# EAGLE design pnc_probe (EAGLE 9.6.0)
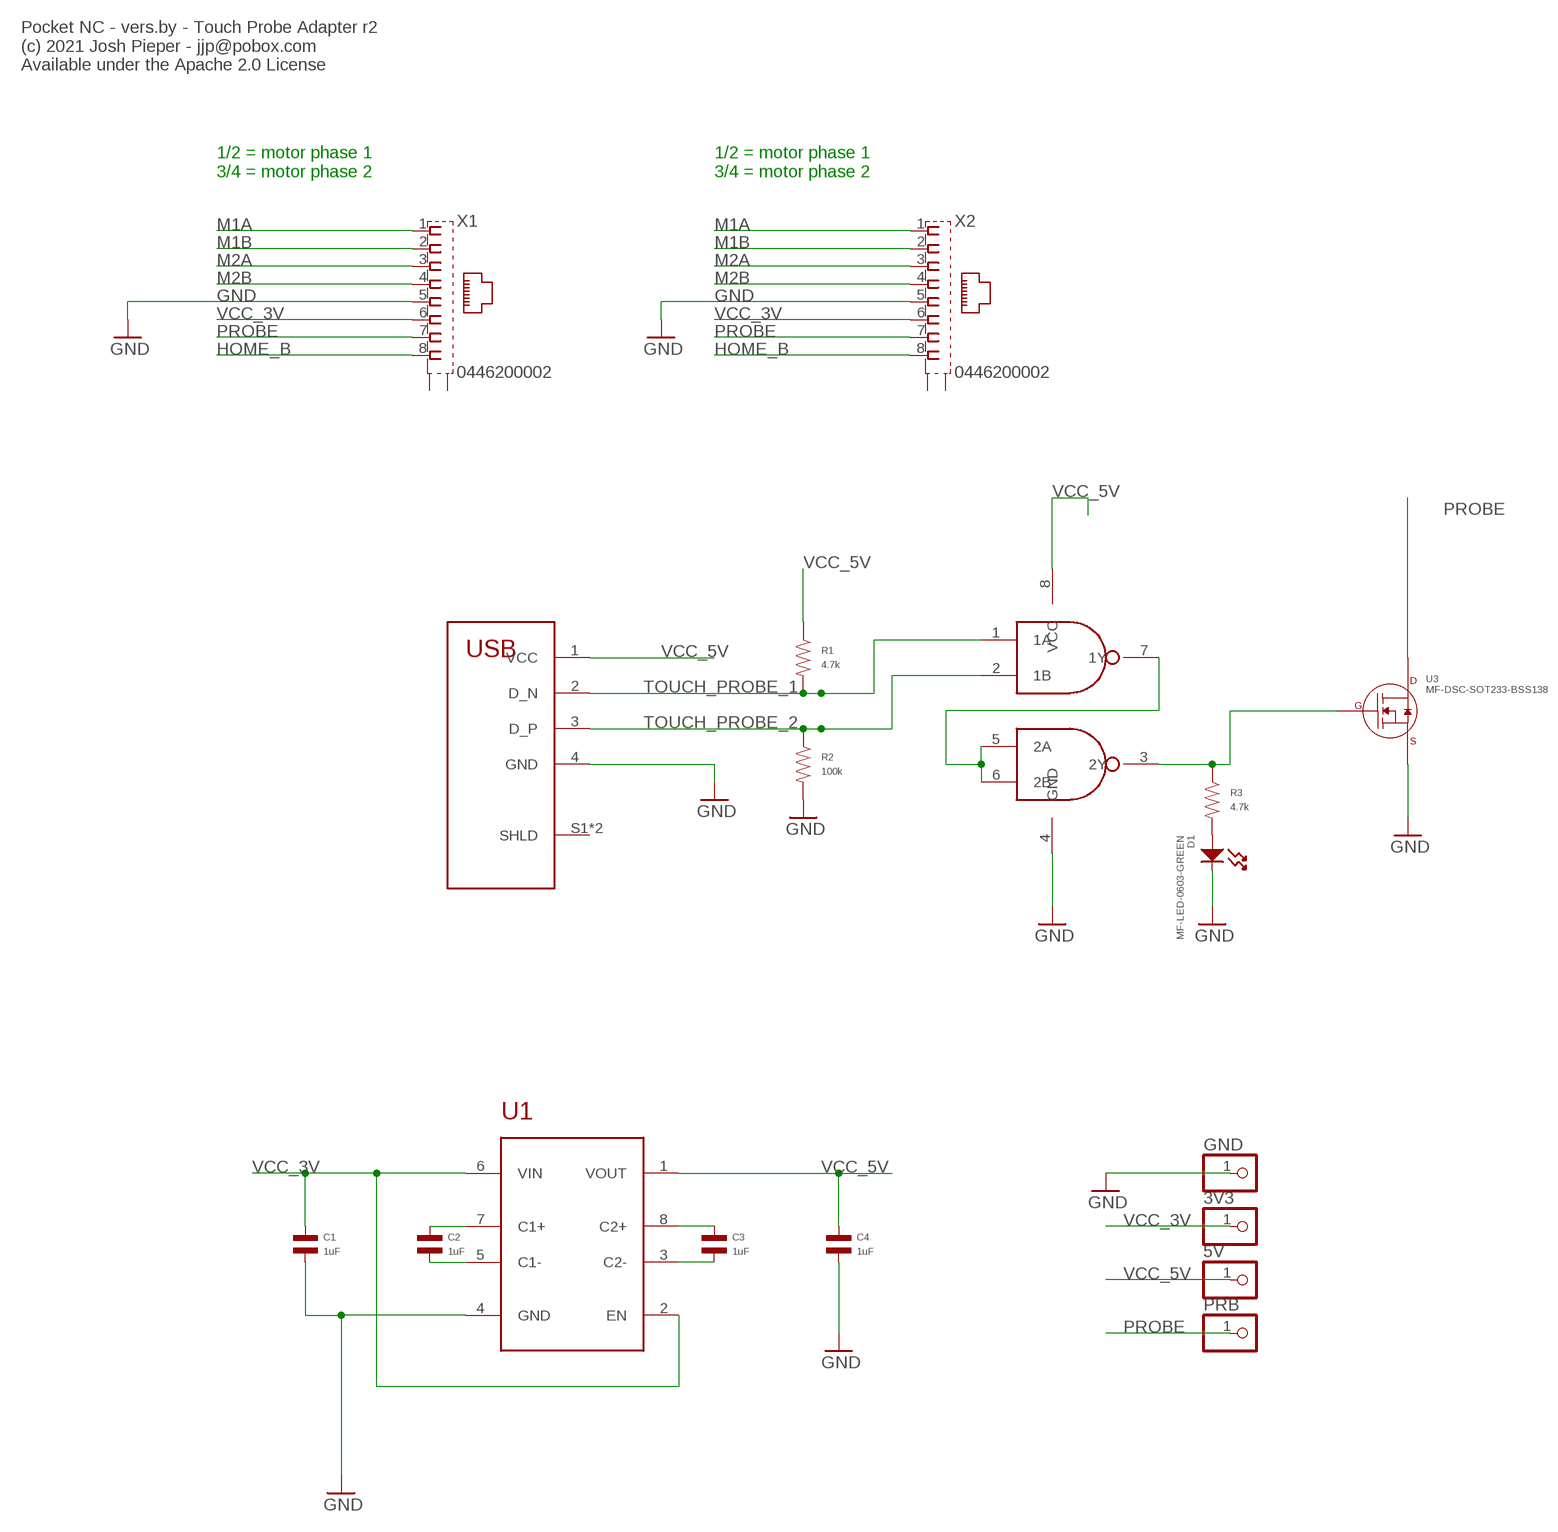
[diagram p0: schematic, sheet 1]

## Parts
3V3  PINHD-1X1  [1X01]
5V  PINHD-1X1  [1X01]
C1  1uF  CAPACITOR_NP_0603  [C0603]
C2  1uF  CAPACITOR_NP_0603  [C0603]
C3  1uF  CAPACITOR_NP_0603  [C0603]
C4  1uF  CAPACITOR_NP_0603  [C0603]
D1  MF-LED-0603-GREEN  LED_SINGLE-0603-GREEN  [LED0603]
GND  PINHD-1X1  [1X01]
PRB  PINHD-1X1  [1X01]
R1  4.7k  RESISTOR_0603  [R0603]
R2  100k  RESISTOR_0603  [R0603]
R3  4.7k  RESISTOR_0603  [R0603]
U1  TPS6024X_VSSOP8  [VSSOP8]
U2  DUAL_NAND_SSOP8  [SSOP8]
U3  MF-DSC-SOT233-BSS138  N-CHANNEL_FET_BSS138_SOT-23-3  [SOT-23-3]
U$1  USBAUSBA  [ONSHORE_USBA_1HSXX]
X1  0446200002  [0446200002]
X2  0446200002  [0446200002]

## Nets
GND: C1.P$2 C4.P$2 D1.CATHODE GND.1 R2.P$2 U1.4(GND) U2.4(GND) U3.P$2(SOURCE) U$1.4(GND) X1.5 X2.5
HOME_B: X1.8 X2.8
M1A: X1.1 X2.1
M1B: X1.2 X2.2
M2A: X1.3 X2.3
M2B: X1.4 X2.4
N$1: U2.5(2A) U2.6(2B) U2.7(1Y)
N$2: C2.P$1 U1.7(C1+)
N$3: D1.ANODE R3.P$2
N$4: R3.P$1 U2.3(2Y) U3.P$1(GATE)
N$5: C2.P$2 U1.5(C1-)
N$6: C3.P$1 U1.8(C2+)
N$7: C3.P$2 U1.3(C2-)
PROBE: PRB.1 U3.P$3(DRAIN) X1.7 X2.7
TOUCH_PROBE_1: R1.P$2 U2.1(1A) U$1.2(D_N)
TOUCH_PROBE_2: R2.P$1 U2.2(1B) U$1.3(D_P)
VCC_3V: 3V3.1 C1.P$1 U1.2(EN) U1.6(VIN) X1.6 X2.6
VCC_5V: 5V.1 C4.P$1 R1.P$1 U1.1(VOUT) U2.8(VCC) U$1.1(VCC)
Unconnected: U$1.S1(SHLD) U$1.S2(SHLD) X1.S@1(S1) X1.S@2(S2) X2.S@1(S1) X2.S@2(S2)

## Notes on the sheet
- Pocket NC - vers.by - Touch Probe Adapter r2
  (c) 2021 Josh Pieper - jjp@pobox.com
  Available under the Apache 2.0 License
- 1/2 = motor phase 1
  3/4 = motor phase 2
- 1/2 = motor phase 1
  3/4 = motor phase 2

## Library data of the parts
3V3 5V GND PRB = pinhead:PINHD-1X1: PIN HEADER
C1-C4 = mfpassives:CAPACITOR_NP: Library: MF_Passives Description: Device for Non-Polarized Capacitors. Manufacture part number (MPN) can be added via Attributes. Check https://factory.macrofab.com/parts for the house parts list.; HOUSEPART: YES; MPN: MF-CAP-0603-1uF; POPULATE: 1
D1 = mfleds:LED_SINGLE: Library: MF_LEDs Description: Device for Single LED Packages. Manufacture part number (MFG#) can be added via Attributes.; HOUSEPART: YES; MPN: MF-LED-0603-GREEN; POPULATE: 1; URL: https://factory.macrofab.com/part/MF-LED-0603-GREEN
R1 = mfpassives:RESISTOR: Library: MF_Passives Description: Device for Resistors. Manufacture part number (MPN), Voltage, Tolerance, and Wattage Rating can be added via Attributes. Check https://factory.macrofab.com/parts for the house parts list.; HOUSEPART: YES; MPN: MF-RES-0603-4.7K; POPULATE: 1
R2 R3 = mfpassives:RESISTOR: Library: MF_Passives Description: Device for Resistors. Manufacture part number (MPN), Voltage, Tolerance, and Wattage Rating can be added via Attributes. Check https://factory.macrofab.com/parts for the house parts list.; HOUSEPART: YES; MPN: MF-RES-0603-100K; POPULATE: 1
U1 = pnc_probe:TPS6024X
U2 = pnc_probe:DUAL_NAND; MF: TI; MPN: SN74LVC2G00DCTR; POPULATE: 1
U3 = mfdiscretesemi:N-CHANNEL_FET: Library: MF_Discrete_Semiconductor Description: Device for Single N-Channel Mosfet. Manufacture part number (MFG#) can be added via Attributes.; HOUSEPART: YES; MPN: MF-DSC-SOT233-BSS138; POPULATE: 1; URL: https://factory.macrofab.com/part/MF-DSC-SOT233-BSS138
U$1 = pnc_probe:USBA; MF: ON SHORE; MPN: USB-A1HSW6; POPULATE: 1
X1 X2 = con-molex:0446200002: RJ-45 INVERTED MODULAR JACK ASSEMBLY WITH RJ-11 KEEPOUT FEATURE Source: Data sheet <http://www.farnell.com/datasheets/73207.pdf> MOLEX 0446200002 BUCHSE, RJ45, GESCHIRMT Source: Farnell <http://de.farnell.com/molex/0446200002/buchse-rj45-geschirmt/dp/9251910?ost=9251910>; MF: MOLEX; MPN: 0446200002; OC_FARNELL: 9251910

## Board
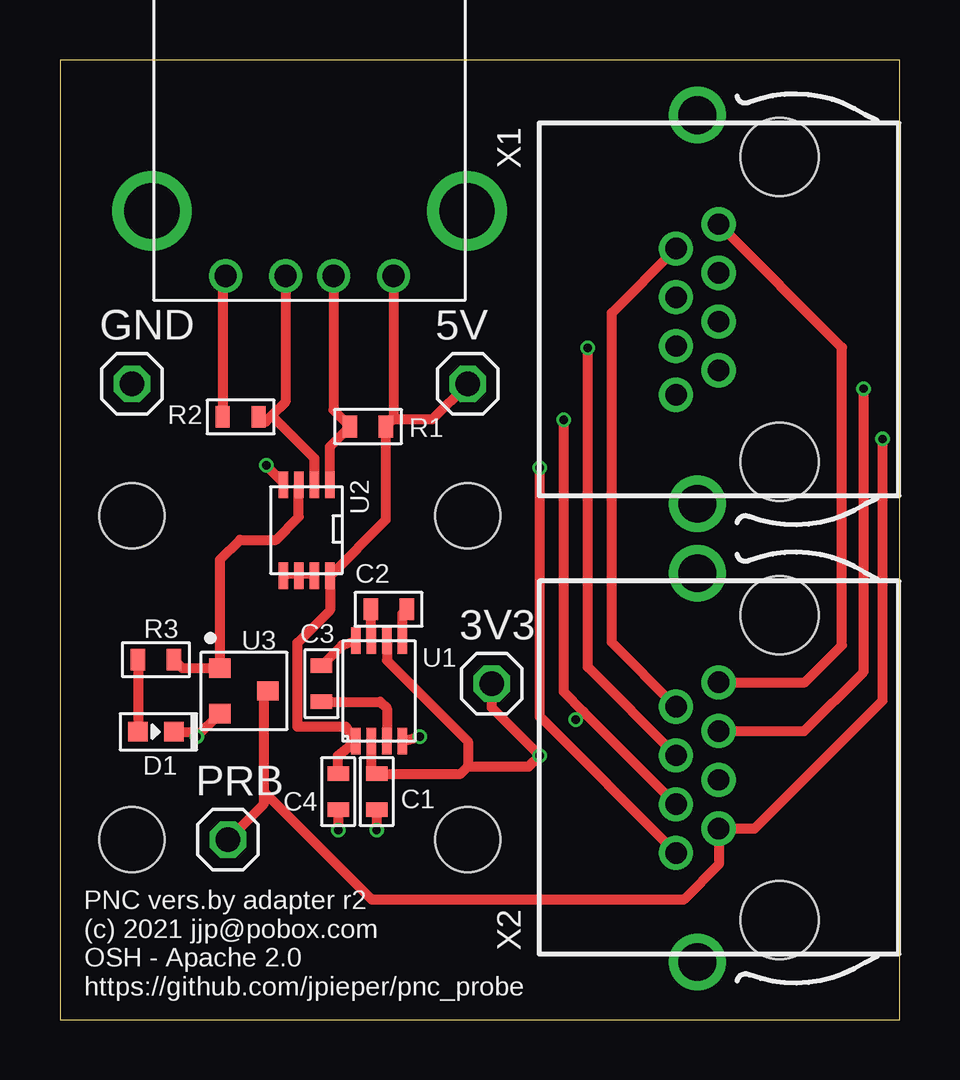
[diagram p1: board, top side]
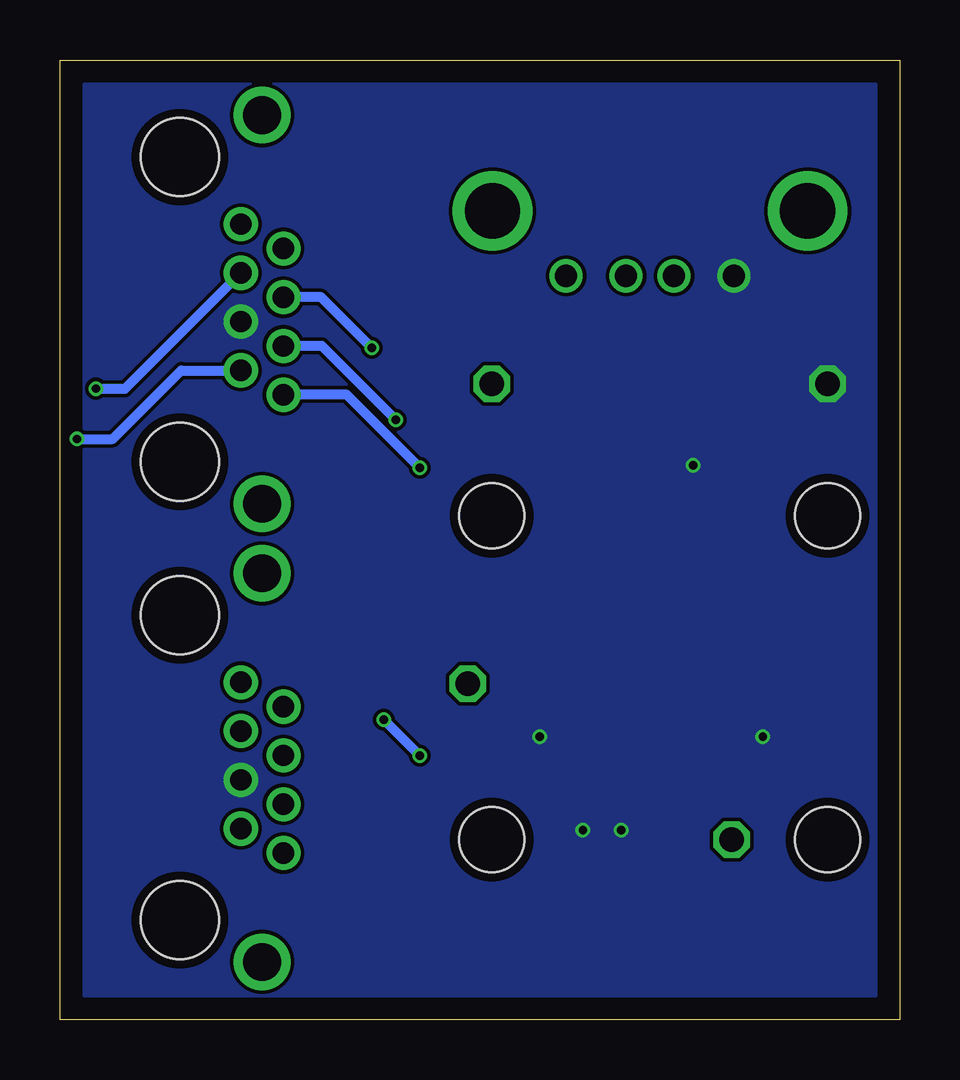
[diagram p2: board, bottom side, seen from below]

Size 35 x 40 mm. Coordinates in mm from the lower left corner, seen from the top.
Outline: 0,0 35,0 35,40 0,40 0,0
Copper layers (1*16): Top 0.035559375mm / dielectric 1.6mm / Bottom 0.035559375mm
Design rules "oshpark-2layer": minimum track width 6mil, minimum drill 10mil, track to track 6mil, track to pad 6mil, pad to pad 6mil, via to via 6mil, smd to smd 6mil, copper to edge 15mil, drill to drill 6mil, minimum pad ring 5mil, minimum via ring 5mil, stop-mask expansion 2.5mil, vias tented up to drill 0mil, thermal gap 10mil
Holes 2.7 mm at 3,21 17,21 3,7.5 17,7.5

### Footprints (pad centres in the part's own frame; a part is rotated, then mirrored left to right if it is on the bottom)
1X01 = drill 1.016 octagon: 1 0,0
C0603 = smd 0.6 x 0.9: P$1 -0.75,0; P$2 0.75,0
LED0603 = smd 0.8 x 0.8: ANODE 0.75,0; CATHODE -0.75,0
R0603 = smd 0.6 x 0.9: P$1 -0.75,0; P$2 0.75,0
VSSOP8 = smd 1.1 x 0.4: 1 -2.1,0.975; 2 -2.1,0.325; 3 -2.1,-0.325; 4 -2.1,-0.975; 5 2.1,-0.975; 6 2.1,-0.325; 7 2.1,0.325; 8 2.1,0.975
SSOP8 = smd 1.1 x 0.4: 1 -1.9,0.975; 2 -1.9,0.325; 3 -1.9,-0.325; 4 -1.9,-0.975; 5 1.9,-0.975; 6 1.9,-0.325; 7 1.9,0.325; 8 1.9,0.975
SOT-23-3 = smd 0.9 x 0.8: P$1 -1,0.95; P$2 -1,-0.95; P$3 1,0
ONSHORE_USBA_1HSXX = drill 0.92: 1 -3.5,0; 2 -1,0; 3 1,0; 4 3.5,0 | drill 2.3: S1 -6.57,-2.71; S2 6.57,-2.71
0446200002 = drill 0.889 pad 1.422: 1 3.556,2.54; 2 2.54,4.318; 3 1.524,2.54; 4 0.508,4.318; 5 -0.508,2.54; 6 -1.524,4.318; 7 -2.54,2.54; 8 -3.556,4.318 | drill 1.575 pad 2.286: S@1 -8.103,3.429; S@2 8.103,3.429 | hole 3.251: 6.35,0; -6.35,0

### Placement (x,y rotation side)
3V3  18,14 0 top
5V  17,26.5 0 top
C1  13.2,9.5 270 top
C2  13.7,17.1 0 top
C3  10.9,14 270 top
C4  11.6,9.5 270 top
D1  4,12 180 top
GND  3,26.5 0 top
PRB  7,7.5 0 top
R1  12.84,24.72 180 top
R2  7.53,25.12 180 top
R3  4,15 180 top
U1  13.3,13.7 90 top
U2  10.28,20.4 270 top
U3  7.67,13.7 0 top
U$1  10.4,31 180 top
X1  30,29.6 90 top
X2  30,10.5 90 top

### Tracks (layer width: path | path; a pad name or v marks a point on that pad's centre or on a via)
GND  (via drill 0.35)
  Top 0.406: U$1.4 6.78,30.88 R2.P$2 | v8.6,23.1 9.3,22.39 U2.4 | D1.CATHODE 5.5,12 v5.7,11.8 6.65,12.75 U3.P$2 | C4.P$2 v11.6,7.9 | C1.P$2 v13.2,7.9 | U1.4 v15,11.8
  pour Bottom (no thermals): 1,39 34,39 34,1 1,1
HOME_B  (via drill 0.35)
  Top 0.406: X2.8 20,12.63 v20,23
  Bottom 0.406: v20,23 23.04,26.04 X1.8
M1A
  Top 0.406: X2.1 31.06,14.06 32.6,15.6 32.6,28.02 X1.1
M1B
  Top 0.406: X2.2 23,15.72 23,29.46 X1.2
M2A  (via drill 0.35)
  Top 0.406: X2.3 31.02,12.02 33.5,14.5 v33.5,26.3
  Bottom 0.406: v33.5,26.3 32.28,26.3 X1.3
M2B  (via drill 0.35)
  Top 0.406: X2.4 22,14.69 v22,28
  Bottom 0.406: v22,28 24.11,30.11 X1.4
N$1
  Top 0.254: U2.7 U2.6 U2.5
N$2
  Top 0.406: U1.7 12.97,17.07 C2.P$1
N$3
  Top 0.406: R3.P$2 D1.ANODE
N$4
  Top 0.406: R3.P$1 5.1,14.65 U3.P$1 6.67,19.17 7.5,20 9,20 9.96,20.95 U2.3
N$5
  Top 0.406: U1.5 14.28,16.93 C2.P$2
N$6
  Top 0.406: C3.P$1 11.75,15.6 U1.8
N$7
  Top 0.406: C3.P$2 13.35,13.25 13.62,12.97 U1.3
PROBE  (via drill 0.35)
  Top 0.406: v34.3,24.2 34.3,13.3 28.96,7.96 X2.7 27.46,6.46 26,5 13,5 8.5,9.5 | 8.5,9.5 8.5,13.53 U3.P$3 | PRB.1 8.5,9 8.5,9.5
  Bottom 0.406: v34.3,24.2 32.8,24.2 29.94,27.06 X1.7
TOUCH_PROBE_1
  Top 0.406: U$1.2 11.4,25.41 R1.P$2 11.26,23.89 U2.1
TOUCH_PROBE_2
  Top 0.406: U$1.3 9.4,25.74 8.83,25.17 | 8.83,25.17 8.58,24.92 8.33,25.17 R2.P$1 | U2.2 10.61,23.39 8.83,25.17
VCC_3V  (via drill 0.35)
  Top 0.406: X2.6 21.83,12.83 | 21.83,12.83 21,13.66 v21,25 | 17,10.55 19.55,10.55 v20,11 18,13 3V3.1 | v21.5,12.5 21.83,12.83 | U1.2 12.97,10.47 C1.P$1 16.7,10.25 17,10.55 | U1.6 13.62,14.97 17,11.6 17,10.55
  Bottom 0.406: v21,25 24.08,28.08 X1.6 | v20,11 v21.5,12.5
VCC_5V
  Top 0.406: U$1.1 13.9,25.03 | 13.9,25.03 R1.P$1 13.59,20.84 U2.8 11.26,17.05 9.9,15.7 9.9,12.2 11.93,12.2 U1.1 11.57,11 11.57,10.28 C4.P$1 | 13.9,25.03 15.53,25.03 5V.1

### Text on the board
tPlace: PNC vers.by adapter r2 / (c) 2021 jjp@pobox.com / OSH - Apache 2.0 / https://github.com/jpieper/pnc_probe